# Altium project IMU.PrjPcb
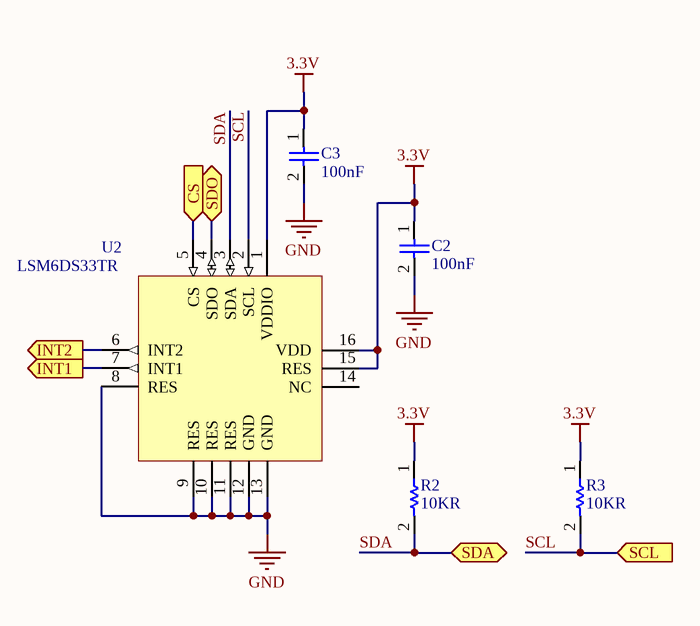
[diagram p0: IMU.SchDoc]
1 sheet, 5 parts. Net scope: flat (ports and power ports of the same name join across sheets).

## Sheet IMU.SchDoc
size A

### Parts
C2  100nF  [MURA-0603_H_0.9_N]
C3  100nF  [MURA-0603_H_0.9_N]
R2  10KR  [RESC1609X50X30NL8T20]
R3  10KR  [RESC1609X50X30NL8T20]
U2  LSM6DS33TR  [*PQFN50P300X300X86-16N]

### Ports
CS (in), INT1 (out), INT2 (out), SCL (in), SDA (bidir), SDO (bidir)

### Nets
3.3V: C2.1 C3.1 R2.1 R3.1 U2.1(VDDIO) U2.15(RES) U2.16(VDD)
GND: C2.2 C3.2 U2.8(RES) U2.9(RES) U2.10(RES) U2.11(RES) U2.12(GND) U2.13(GND)
SCL: R3.2 U2.2(SCL) ; port SCL
SDA: R2.2 U2.3(SDA) ; port SDA
NetU2_4: U2.4(SDO) ; port SDO
NetU2_5: U2.5(CS) ; port CS
NetU2_6: U2.6(INT2) ; port INT2
NetU2_7: U2.7(INT1) ; port INT1

Not connected (* = marked no-connect by the designer): U2 14(NC)

### Library data of the parts
C2 C3 = C0603C104M4RAC7411: X7R,.1UF,20%,16V,UNMARKED, 1.0A 40V ROHS 3K<AZ; Manufacturer: KEMET; Dielectric Material: Ceramic; Dissipation Factor: 3.5%; Supplier 1: Digi-Key; Manufacturer Part Number: C0603C104M4RAC7411; RoHS: Yes; Category: Ceramic Capacitors; Stock 1: 270000; Pricing 1: 15000=0.00520, 30000=0.00494, 75000=0.00442, 105000=0.00358 (USD); Mount: Surface Mount; Case/Package: 0603; Case Code (Imperial): 0603; Case Code (Metric): 1608; Min Operating Temperature: -55°C; Max Operating Temperature: 125°C; Capacitance: 100nF; Package Quantity: 10000; Voltage Rating: 16V; Tolerance: 20%; Packaging: Tape and Reel; Voltage Rating (DC): 16V; Dielectric: X7R; Termination: SMD/SMT; Length: 1.6mm; Height: 0.8mm; Width: 0.8mm; Lead Pitch: 0.7mm; Thickness: 0.034inch; Depth: 0.8mm; Radiation Hardening: No; ComponentLink1URL: http://www.mouser.com/ds/2/212/KEM_C1002_X7R_SMD-1102033.pdf?src-supplier=Mouser; ComponentLink1Description: http://www.mouser.com/ds/2/212/KEM_C1002_X7R_SMD-1102033.pdf?src-supplier=Mouser; ComponentLink2URL: http://www.farnell.com/datasheets/2747785.pdf?src-supplier=Farnell; ComponentLink2Description: http://www.farnell.com/datasheets/2747785.pdf?src-supplier=Farnell; ComponentLink3URL: http://components.arrow.com/part/dataview/3446650S8993799N7429?src-supplier=Arrow; ComponentLink3Description: http://components.arrow.com/part/dataview/3446650S8993799N7429?src-supplier=Arrow; ComponentLink4URL: http://www.jameco.com/Jameco/Products/ProdDS/1565046.pdf?src-supplier=Jameco; ComponentLink4Description: http://www.jameco.com/Jameco/Products/ProdDS/1565046.pdf?src-supplier=Jameco; ComponentLink5URL: http://capacitoredge.kemet.com/capedge2/DataSheet?pn=C0603C104M4RAC7411&src-supplier=Avnet; ComponentLink5Description: http://capacitoredge.kemet.com/capedge2/DataSheet?pn=C0603C104M4RAC7411&src-supplier=Avnet; ComponentLink6URL: https://api.kemet.com/component-edge/download/datasheet/C0603C104M4RAC7411.pdf?src-supplier=Digi-Key; ComponentLink6Description: https://api.kemet.com/component-edge/download/datasheet/C0603C104M4RAC7411.pdf?src-supplier=Digi-Key; ComponentLink7URL: http://www.kemet.com/docfinder?Partnumber=C0603C104M4RAC7411&src-supplier=Digi-Key; ComponentLink7Description: http://www.kemet.com/docfinder?Partnumber=C0603C104M4RAC7411&src-supplier=Digi-Key; ComponentLink8URL: https://www.verical.com/server-webapp/html/getDatasheet?partID=58458&src-supplier=Verical; ComponentLink8Description: https://www.verical.com/server-webapp/html/getDatasheet?partID=58458&src-supplier=Verical; ComponentLink9URL: http://capacitoredge.kemet.com/capedge2/DataSheet?pn=C0603C104M4RAC7411&src-supplier=Avnet+Europe; ComponentLink9Description: http://capacitoredge.kemet.com/capedge2/DataSheet?pn=C0603C104M4RAC7411&src-supplier=Avnet+Europe; Supplier Part Number 1: 399-5784-2-ND
R2 R3 = CRCW060310K0FKEA: VISHAY - CRCW060310K0FKEA - SMD Chip Resistor, 0603 [1608 Metric], 10 kohm, CRCW e3 Series, 75 V, Thick Film, 100 mW; Tolerance: 1%; Voltage Rating: 75V; Power Rating: 100mW; Temperature Coefficient: 100ppm/°C; Supplier 1: Digi-Key; Manufacturer: Vishay; Manufacturer Part Number: CRCW060310K0FKEA; RoHS: Yes; Category: Chip SMD Resistors; Stock 1: 491908; Pricing 1: 1=0.10000, 10=0.03400, 100=0.01390, 1000=0.00623, 2500=0.00540 (USD); Case/Package: 0603; Number of Pins: 2; Weight: 7.1E-05oz; Case Code (Metric): 1608; Case Code (Imperial): 0603; Contact Plating: Tin,Lead; Min Operating Temperature: -55°C; Max Operating Temperature: 155°C; Packaging: Tape and Reel; Termination: SMD/SMT; Package Quantity: 10; Voltage Rating (DC): 75V; Resistance: 10kR; Composition: Thick Film; Military Standard: Not; Max Power Dissipation: 100mW; Features: Automotive AEC-Q200; Number of Terminations: 2; Length: 1.55mm; Height: 0.45mm; Width: 0.033inch; Depth: 0.85mm; Radiation Hardening: No; REACH SVHC: Unknown; Lead Free: Lead Free; ComponentLink1URL: https://datasheet.ciiva.com/11809/0900766b80d98afc-11809037.pdf?src-supplier=RSComponents; ComponentLink1Description: https://datasheet.ciiva.com/11809/0900766b80d98afc-11809037.pdf?src-supplier=RSComponents; ComponentLink2URL: https://datasheet.ciiva.com/16886/dcrcw-16886037.pdf?src-supplier=Avnet+Europe; ComponentLink2Description: https://datasheet.ciiva.com/16886/dcrcw-16886037.pdf?src-supplier=Avnet+Europe; ComponentLink3URL: https://datasheet.ciiva.com/26821/getdatasheetpartid-86831-26821109.pdf?src-supplier=Verical; ComponentLink3Description: https://datasheet.ciiva.com/26821/getdatasheetpartid-86831-26821109.pdf?src-supplier=Verical; ComponentLink4URL: https://datasheet.ciiva.com/16754/70201119-16754710.pdf?src-supplier=Allied+Electronics; ComponentLink4Description: https://datasheet.ciiva.com/16754/70201119-16754710.pdf?src-supplier=Allied+Electronics; ComponentLink5URL: https://datasheet.ciiva.com/16719/70201119-16719704.pdf?src-supplier=Allied+Electronics; ComponentLink5Description: https://datasheet.ciiva.com/16719/70201119-16719704.pdf?src-supplier=Allied+Electronics; ComponentLink6URL: https://datasheet.ciiva.com/2465/dcrcwe3-2465513.pdf?src-supplier=Digi-Key; ComponentLink6Description: https://datasheet.ciiva.com/2465/dcrcwe3-2465513.pdf?src-supplier=Digi-Key; ComponentLink7URL: https://datasheet.ciiva.com/5543/dcrcwe3-109170-5543001.pdf?src-supplier=Mouser; ComponentLink7Description: https://datasheet.ciiva.com/5543/dcrcwe3-109170-5543001.pdf?src-supplier=Mouser; ComponentLink8URL: https://datasheet.ciiva.com/2465/dcrcwe3-2465514.pdf?src-supplier=Digi-Key; ComponentLink8Description: https://datasheet.ciiva.com/2465/dcrcwe3-2465514.pdf?src-supplier=Digi-Key; ComponentLink9URL: https://datasheet.ciiva.com/46385/1697337-46385498.pdf?src-supplier=Element14; ComponentLink9Description: https://datasheet.ciiva.com/46385/1697337-46385498.pdf?src-supplier=Element14; ComponentLink10URL: https://datasheet.ciiva.com/2465/dcrcwe3-2465515.pdf?src-supplier=Digi-Key; ComponentLink10Description: https://datasheet.ciiva.com/2465/dcrcwe3-2465515.pdf?src-supplier=Digi-Key; ComponentLink11URL: https://datasheet.ciiva.com/3256/dcrcwe3-3256939.pdf?src-supplier=Avnet; ComponentLink11Description: https://datasheet.ciiva.com/3256/dcrcwe3-3256939.pdf?src-supplier=Avnet; ComponentLink12URL: https://datasheet.ciiva.com/3256/dcrcwe3-3256940.pdf?src-supplier=Avnet; ComponentLink12Description: https://datasheet.ciiva.com/3256/dcrcwe3-3256940.pdf?src-supplier=Avnet; ComponentLink13URL: https://datasheet.ciiva.com/16209/dcrcwe3-16209164.pdf?src-supplier=Future+Electronics; ComponentLink13Description: https://datasheet.ciiva.com/16209/dcrcwe3-16209164.pdf?src-supplier=Future+Electronics; ComponentLink14URL: https://datasheet.ciiva.com/26314/fld-crcw-e3-data-en-26314749.pdf?src-supplier=Distrelec; ComponentLink14Description: https://datasheet.ciiva.com/26314/fld-crcw-e3-data-en-26314749.pdf?src-supplier=Distrelec; Supplier Part Number 1: 541-10.0KHDKR-ND
U2 = LSM6DS33TR: MOTION MEMS CONSUMER; Manufacturer: STMicroelectronics; Sensor Type: Accelerometer,Gyroscope,3 Axis,Temperature; Output Type: SPI,I2C; Supplier 1: Avnet; Manufacturer Part Number: LSM6DS33TR; RoHS: Yes; Category: Inertial Measurement Units (IMUs); Pricing 1: 1=2.91000, 10=2.57000, 25=2.42000, 50=2.27000, 100=2.14000 (USD); Mount: Surface Mount; Case/Package: LGA; Min Operating Temperature: -40°C; Max Operating Temperature: 85°C; Packaging: Tape and Reel; ComponentLink1URL: http://www.farnell.com/datasheets/2291205.pdf?src-supplier=Farnell; ComponentLink1Description: http://www.farnell.com/datasheets/2291205.pdf?src-supplier=Farnell; ComponentLink2URL: http://www.farnell.com/datasheets/2291205.pdf?src-supplier=Newark; ComponentLink2Description: http://www.farnell.com/datasheets/2291205.pdf?src-supplier=Newark; ComponentLink3URL: http://www.st.com/content/ccc/resource/technical/document/datasheet/ed/aa/b8/e5/ab/3a/41/df/DM00157718.pdf/files/DM00157718.pdf/jcr:content/translations/en.DM00157718.pdf?src-supplier=Digi-Key; ComponentLink3Description: http://www.st.com/content/ccc/resource/technical/document/datasheet/ed/aa/b8/e5/ab/3a/41/df/DM00157718.pdf/files/DM00157718.pdf/jcr:content/translations/en.DM00157718.pdf?src-supplier=Digi-Key; Supplier Part Number 1: 18AC7419